# Altium schematic sheet fpga schematic.SchDoc
size A
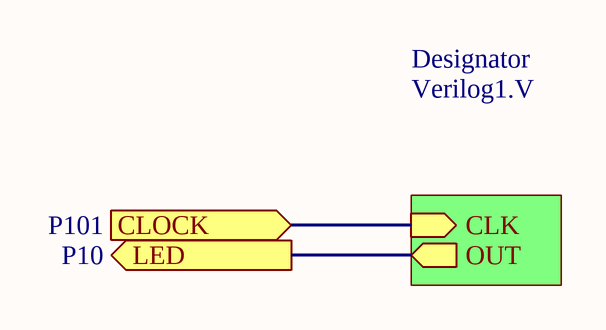
[diagram p0: fpga schematic.SchDoc]

## Sub-sheets
Designator = Verilog1.V: OUT (out), CLK (in)

## Ports
CLOCK (in, see P101), LED (out, see P10)

## Nets
CLOCK: port CLOCK, sheet Designator/CLK
LED: port LED, sheet Designator/OUT